# Altium schematic sheet 15_FLASH-NAND_FLASH.SchDoc: P30L
size A3; Organization: 六零加智能科技; Address4: www.nidone.com.cn; DocumentNumber: Kang jin; Revision: 1.0; SheetNumber: 15; SheetTotal: 23
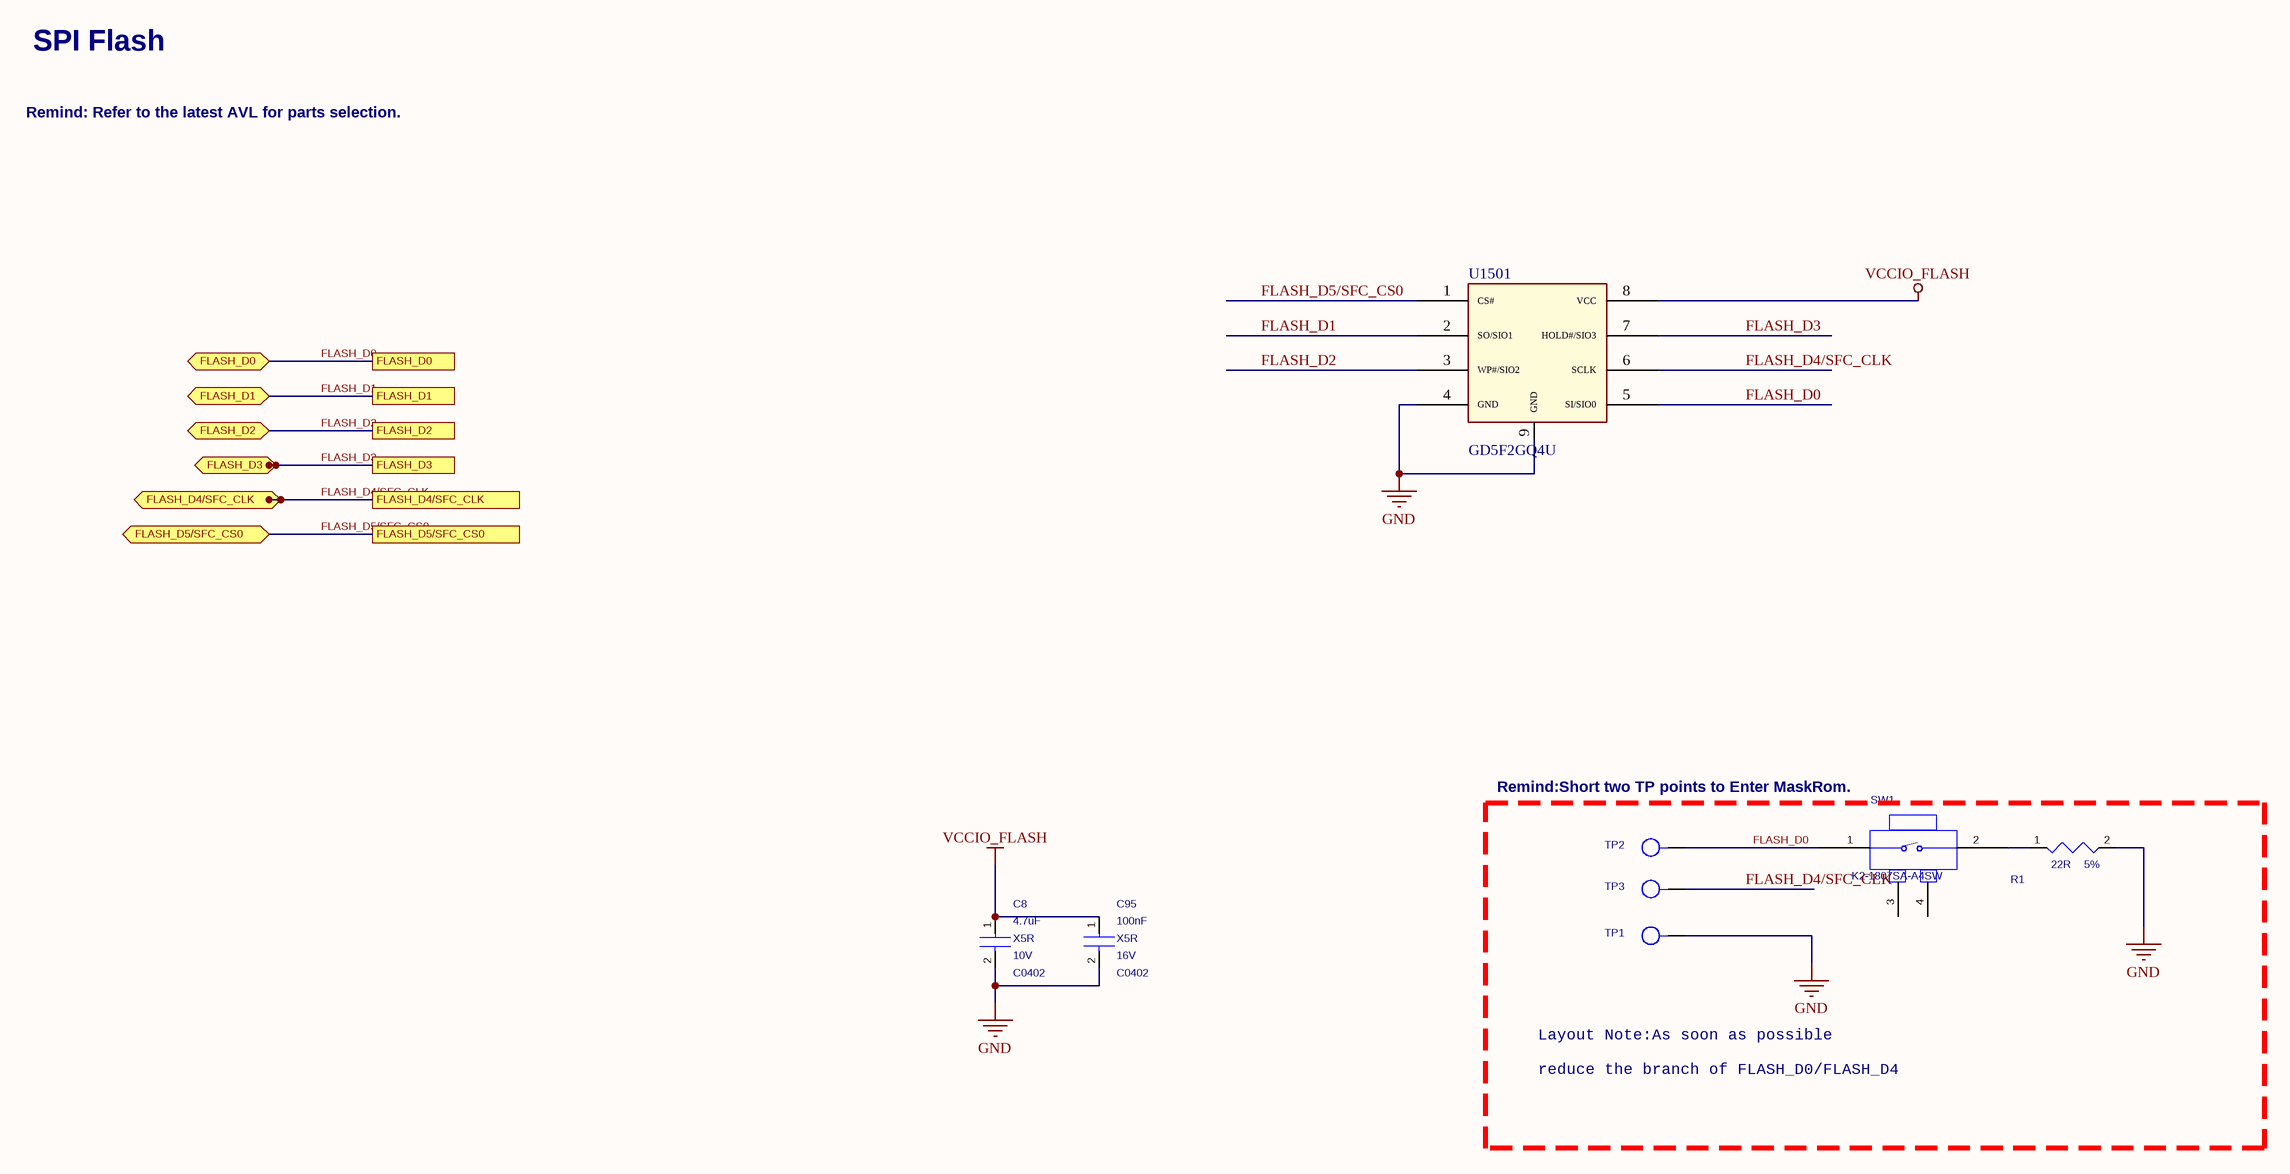
[diagram p0: 15_FLASH-NAND_FLASH.SchDoc]

## Parts
C8  value 4.7uF  Dielectric: X5R  Voltage: 10V  [C0402]  (hidden comment: CAP_NP_2)
C95  value 100nF  Voltage: 16V  Dielectric: X5R  [C0402]  (hidden comment: CAP_NP_2)
R1  value 22R  Tolerance: 5%  [R0402]  (hidden comment: RESISTOR)
SW1  K2-1807SA-A4SW  [P2]
TP1  TP  [TEST]  (value not drawn)
TP2  TP  [TEST]  (value not drawn)
TP3  TP  [TEST]  (value not drawn)
U1501  GD5F2GQ4U  [LGA8]

## Ports
FLASH_D0, FLASH_D0 (bidir), FLASH_D1, FLASH_D1 (bidir), FLASH_D2, FLASH_D2 (bidir), FLASH_D3, FLASH_D3 (bidir), FLASH_D4/SFC_CLK, FLASH_D4/SFC_CLK (bidir), FLASH_D5/SFC_CS0, FLASH_D5/SFC_CS0 (bidir)

## Nets
GND: C8.2 C95.2 R1.2 TP1.1 U1501.4(GND) U1501.9(GND)
VCCIO_FLASH: C8.1 C95.1 U1501.8(VCC)
FLASH_D0: SW1.1 TP2.1 U1501.5(SI/SIO0) ; port FLASH_D0
FLASH_D1: U1501.2(SO/SIO1) ; port FLASH_D1
FLASH_D2: U1501.3(WP#/SIO2) ; port FLASH_D2
FLASH_D3: U1501.7(HOLD#/SIO3) ; port FLASH_D3
FLASH_D4/SFC_CLK: TP3.1 U1501.6(SCLK) ; port FLASH_D4/SFC_CLK
FLASH_D5/SFC_CS0: U1501.1(CS#) ; port FLASH_D5/SFC_CS0
NetR1_1: R1.1 SW1.2

Not connected (* = marked no-connect by the designer): SW1 3 4

## Notes on the sheet
- SPI Flash
- Remind: Refer to the latest AVL for parts selection.
- Remind:Short two TP points to Enter MaskRom.
- Layout Note:As soon as possible
- reduce the branch of FLASH_D0/FLASH_D4
- Title
- Size:
- Date:
- A3
- Engineer:
- Time:
- Revision:
- Sheet
- of
- File:

## Library data of the parts
C8 = CAP_NP_2: cap,4.70uF,+/-10%,10V,X5R,C0402; Manufacturer: TDK; RK_PN: C1005X5R1A475K050BC; Priority: A; Tolerance: 10%; Created_by: JJJ; Source_Path: Z:\RK_STANDARD_LIBRARY\CADENCE_CIS\RK_DISCRETE.OLB; Number: 1; Part_Type: C0402; Manufacturer_PN: C1005X5R1A475K050BC; PCB DECAL: C0402
C95 = CAP_NP_2: cap,100.00nF,+/-10%,16V,X5R,C0402; Manufacturer_PN: C1005X5R1C104K050BA; Manufacturer: TDK; Created_by: JJJ; Tolerance: 10%; Priority: A; Source_Path: Z:\RK_STANDARD_LIBRARY\CADENCE_CIS\RK_DISCRETE.OLB; Number: 1; Part_Type: C0402; RK_PN: C1005X5R1C104K050BA; PCB DECAL: C0402
R1 = RESISTOR: ?用厚膜电阻,22R,+/-5%,R0402,1/16W.; Manufacturer: YAGEO; RK_PN: RC0402JR-0722RL; Priority: A; Wattage: 1/16W; Created_by: YTL; Source_Path: Z:\RK_STANDARD_LIBRARY\CADENCE_CIS\RK_DISCRETE.OLB; number: 1; PCB DECAL: R0402; Part_Type: ?用厚膜电阻; Manufacturer_PN: RC0402JR-0722RL
SW1 = K2-1807SA-A4SW: Part_Type: SWITCH; Manufacturer: HRO; Remark: 连接器; Number: 1; PCB DECAL: K2-1807SA; Value: K2-1807SA-A4SW; Manufacturer_PN: K2-1807SA-A4SW
TP1-TP3 = TP: PCB DECAL: PAD_10; Source_Path: Z:\CAPTURE_CIS\REFERENCE\SYMBOL\TP.OLB; reserve: DEPOP; Option: DNP
U1501 = GD5F2Q4U